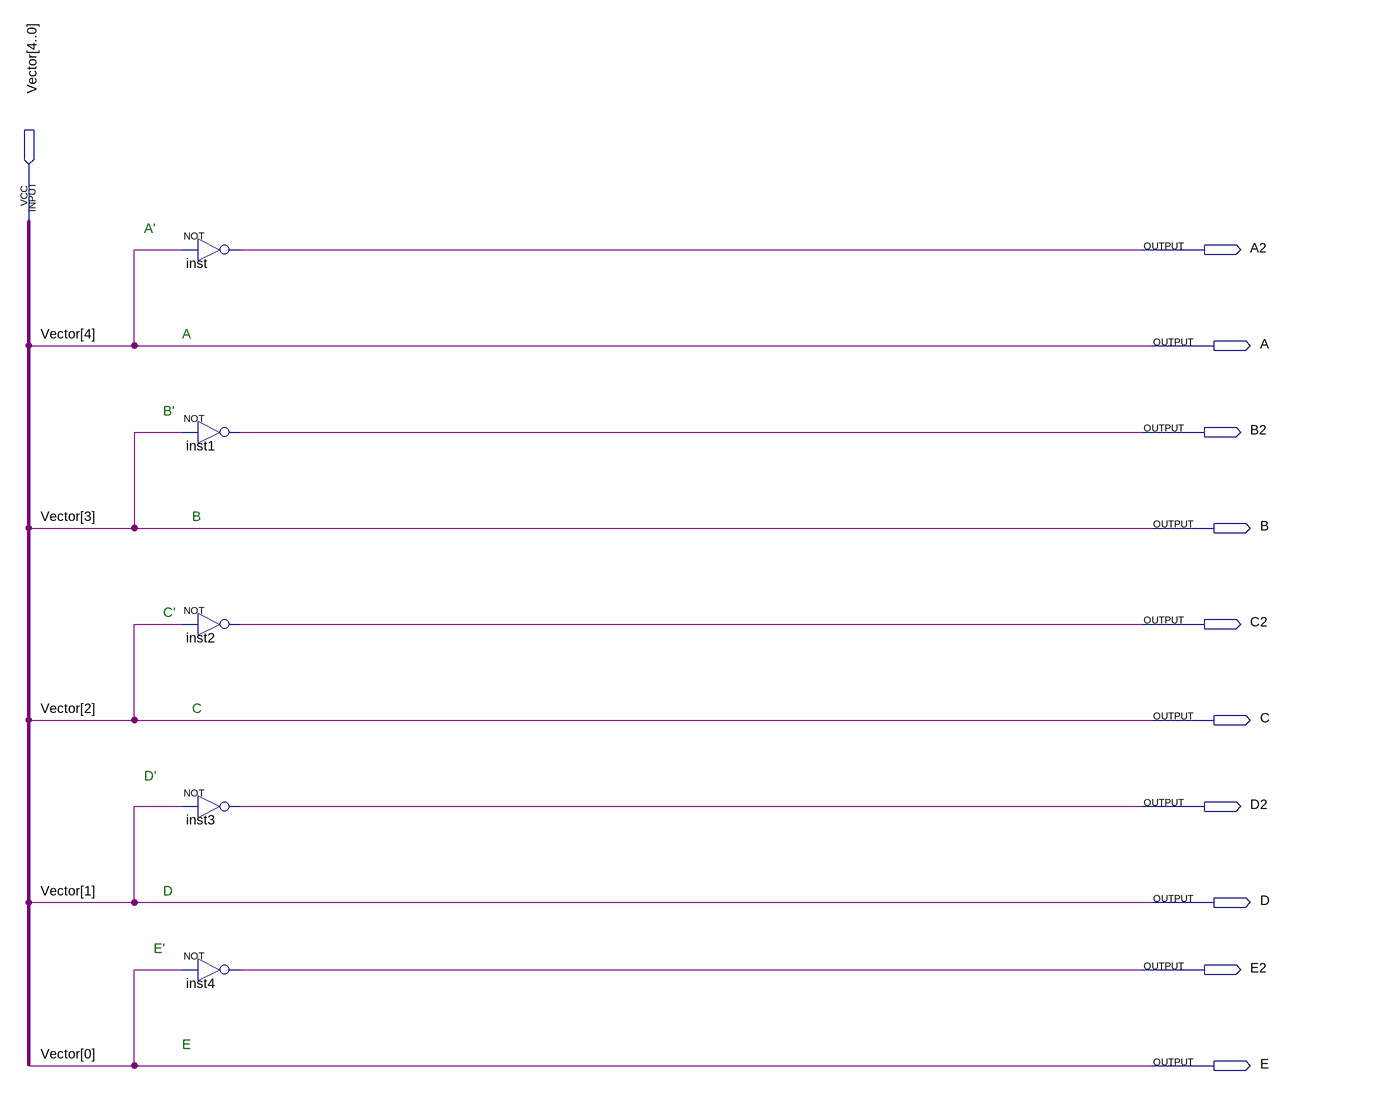
[diagram p0: schematic sheet]
// Quartus schematic all_entradas.bdf as structural Verilog: 5 symbols, 11 pins
module all_entradas (
  input  [4:0] Vector,
  output A2,
  output A,
  output B2,
  output B,
  output C2,
  output C,
  output D2,
  output D,
  output E2,
  output E
);

  not inst (A2, Vector[4]);
  not inst1 (B2, Vector[3]);
  not inst2 (C2, Vector[2]);
  not inst3 (D2, Vector[1]);
  not inst4 (E2, Vector[0]);

  assign A = Vector[4];
  assign B = Vector[3];
  assign C = Vector[2];
  assign D = Vector[1];
  assign E = Vector[0];

  // Notes on the sheet:
  //   A'
  //   A
  //   B'
  //   B
  //   C'
  //   C
  //   D'
  //   D
  //   E'
  //   E
endmodule
